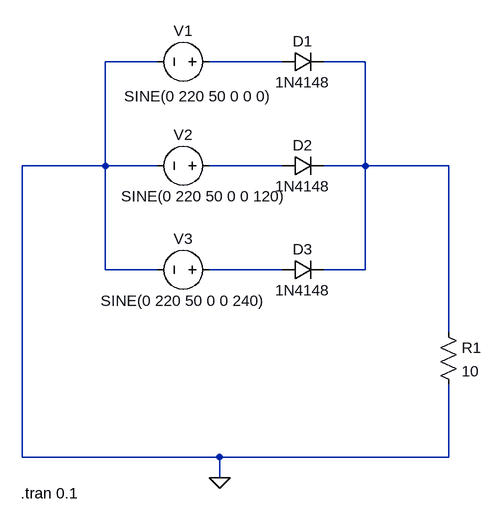
[diagram p0: schematic 3 Phase HWR.asc]
3 Phase HWR.asc, the LTspice schematic file:
Version 4
SHEET 1 880 680
WIRE 16 0 -64 0
WIRE 208 0 96 0
WIRE 336 0 272 0
WIRE -64 160 -64 0
WIRE -64 160 -192 160
WIRE 16 160 -64 160
WIRE 208 160 96 160
WIRE 336 160 336 0
WIRE 336 160 272 160
WIRE 464 160 336 160
WIRE -64 320 -64 160
WIRE 16 320 -64 320
WIRE 208 320 96 320
WIRE 336 320 336 160
WIRE 336 320 272 320
WIRE 464 416 464 160
WIRE -192 608 -192 160
WIRE 112 608 -192 608
WIRE 464 608 464 496
WIRE 464 608 112 608
WIRE 112 640 112 608
FLAG 112 640 0
SYMBOL voltage 112 0 R90
WINDOW 0 -32 56 VBottom 2
WINDOW 3 37 33 VTop 2
WINDOW 123 0 0 Left 0
WINDOW 39 0 0 Left 0
SYMATTR InstName V1
SYMATTR Value SINE(0 220 50 0 0 0)
SYMBOL voltage 112 160 R90
WINDOW 0 -32 56 VBottom 2
WINDOW 3 31 24 VTop 2
WINDOW 123 0 0 Left 0
WINDOW 39 0 0 Left 0
SYMATTR InstName V2
SYMATTR Value SINE(0 220 50 0 0 120)
SYMBOL voltage 112 320 R90
WINDOW 0 -32 56 VBottom 2
WINDOW 3 32 56 VTop 2
WINDOW 123 0 0 Left 0
WINDOW 39 0 0 Left 0
SYMATTR InstName V3
SYMATTR Value SINE(0 220 50 0 0 240)
SYMBOL diode 208 16 R270
WINDOW 0 32 32 VTop 2
WINDOW 3 0 32 VBottom 2
SYMATTR InstName D1
SYMATTR Value 1N4148
SYMBOL diode 208 176 R270
WINDOW 0 32 32 VTop 2
WINDOW 3 0 32 VBottom 2
SYMATTR InstName D2
SYMATTR Value 1N4148
SYMBOL diode 208 336 R270
WINDOW 0 32 32 VTop 2
WINDOW 3 0 32 VBottom 2
SYMATTR InstName D3
SYMATTR Value 1N4148
SYMBOL res 448 400 R0
SYMATTR InstName R1
SYMATTR Value 10
TEXT -194 664 Left 2 !.tran 0.1

The netlist it stands for:
* 3 Phase HWR.asc
V1 N001 0 SINE(0 220 50 0 0 0)
V2 N003 0 SINE(0 220 50 0 0 120)
V3 N004 0 SINE(0 220 50 0 0 240)
D1 N001 N002 1N4148
D2 N003 N002 1N4148
D3 N004 N002 1N4148
R1 N002 0 10
.model D D
.lib standard.dio
.tran 0.1
.backanno
.end